# Altium schematic sheet Main_board.SchDoc
size A1; SheetNumber: 1; SheetTotal: 1
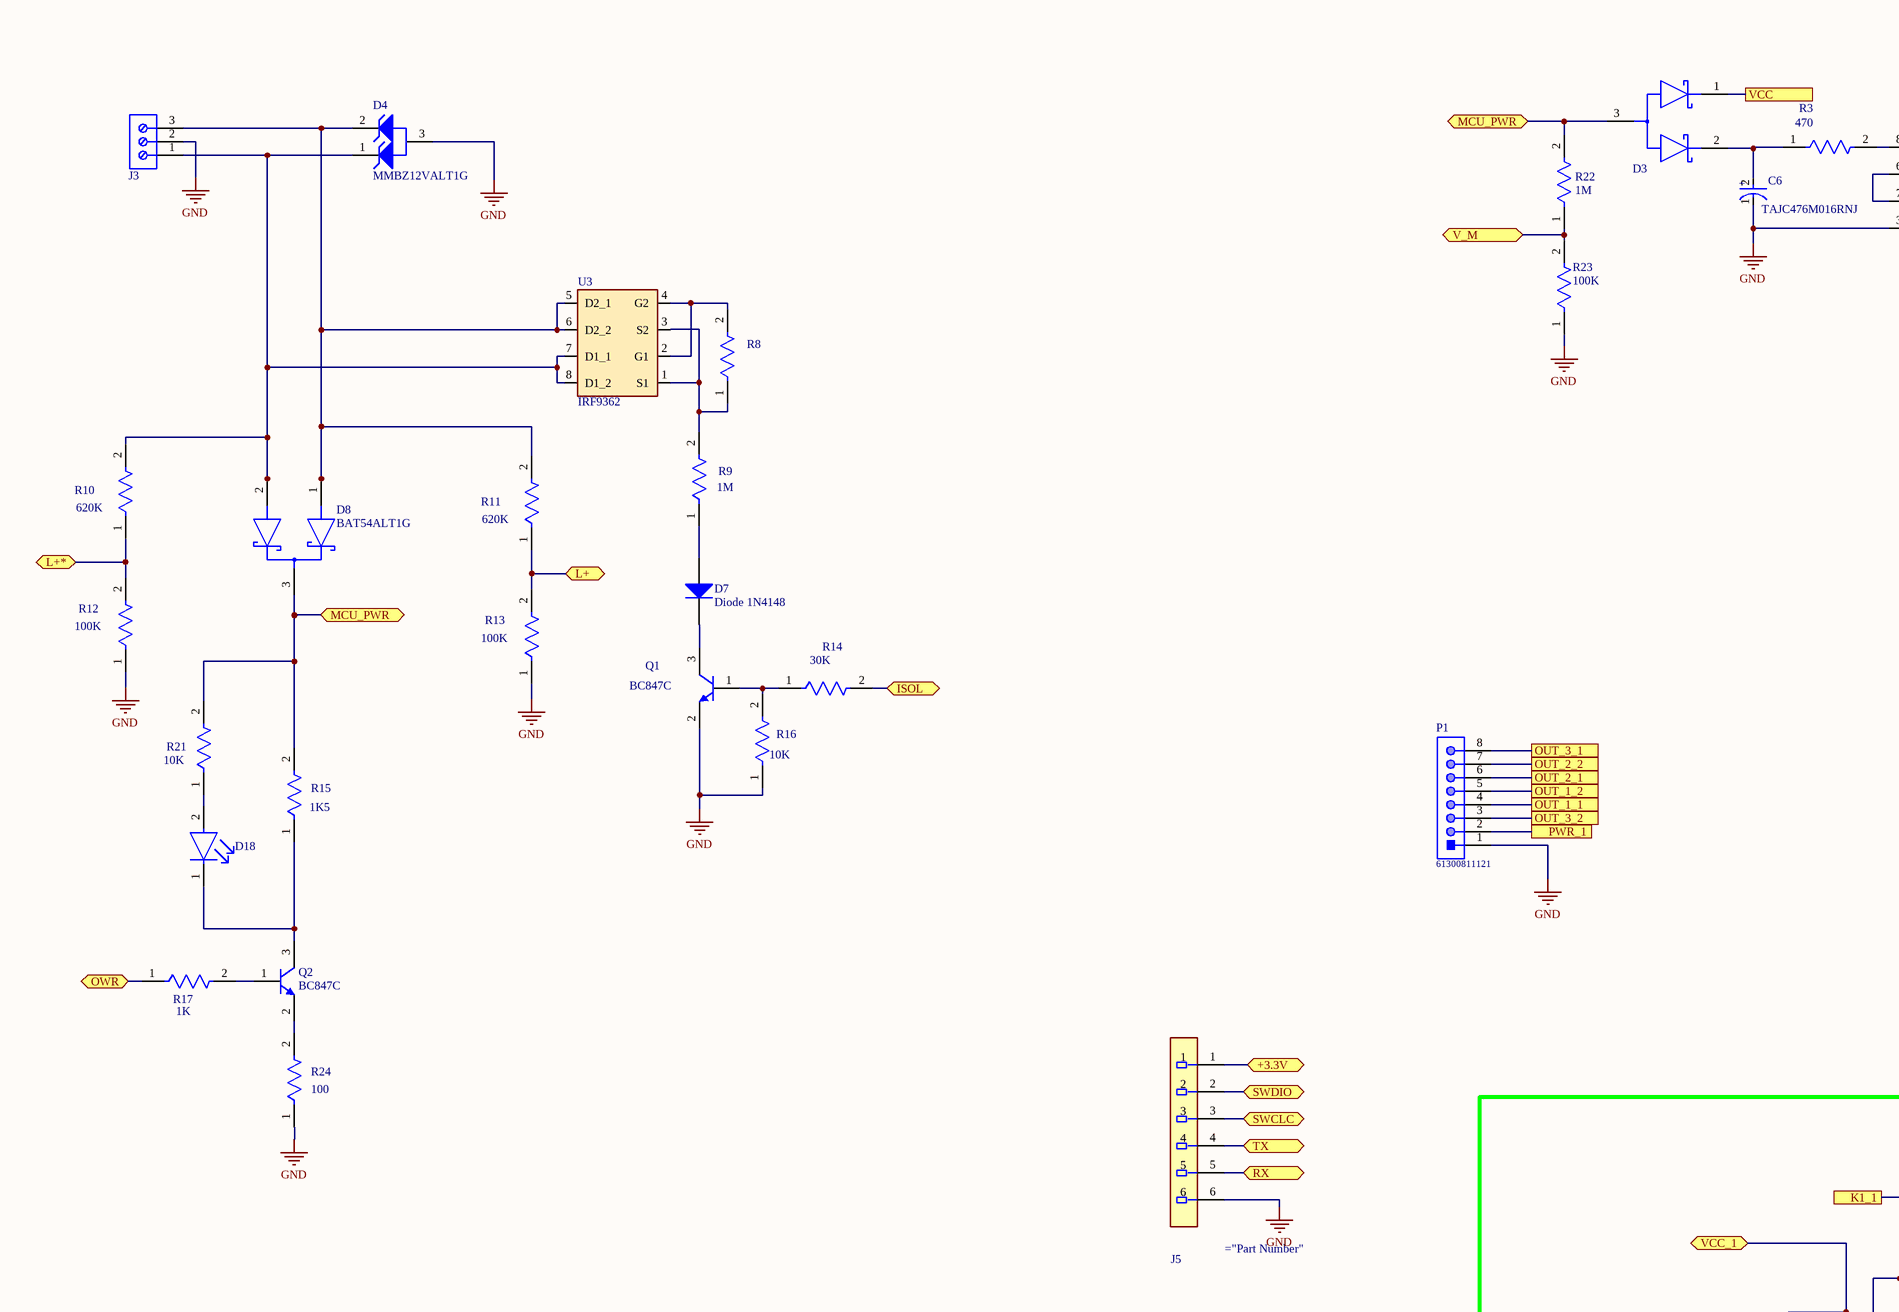
[diagram p0: Main_board.SchDoc, top left]
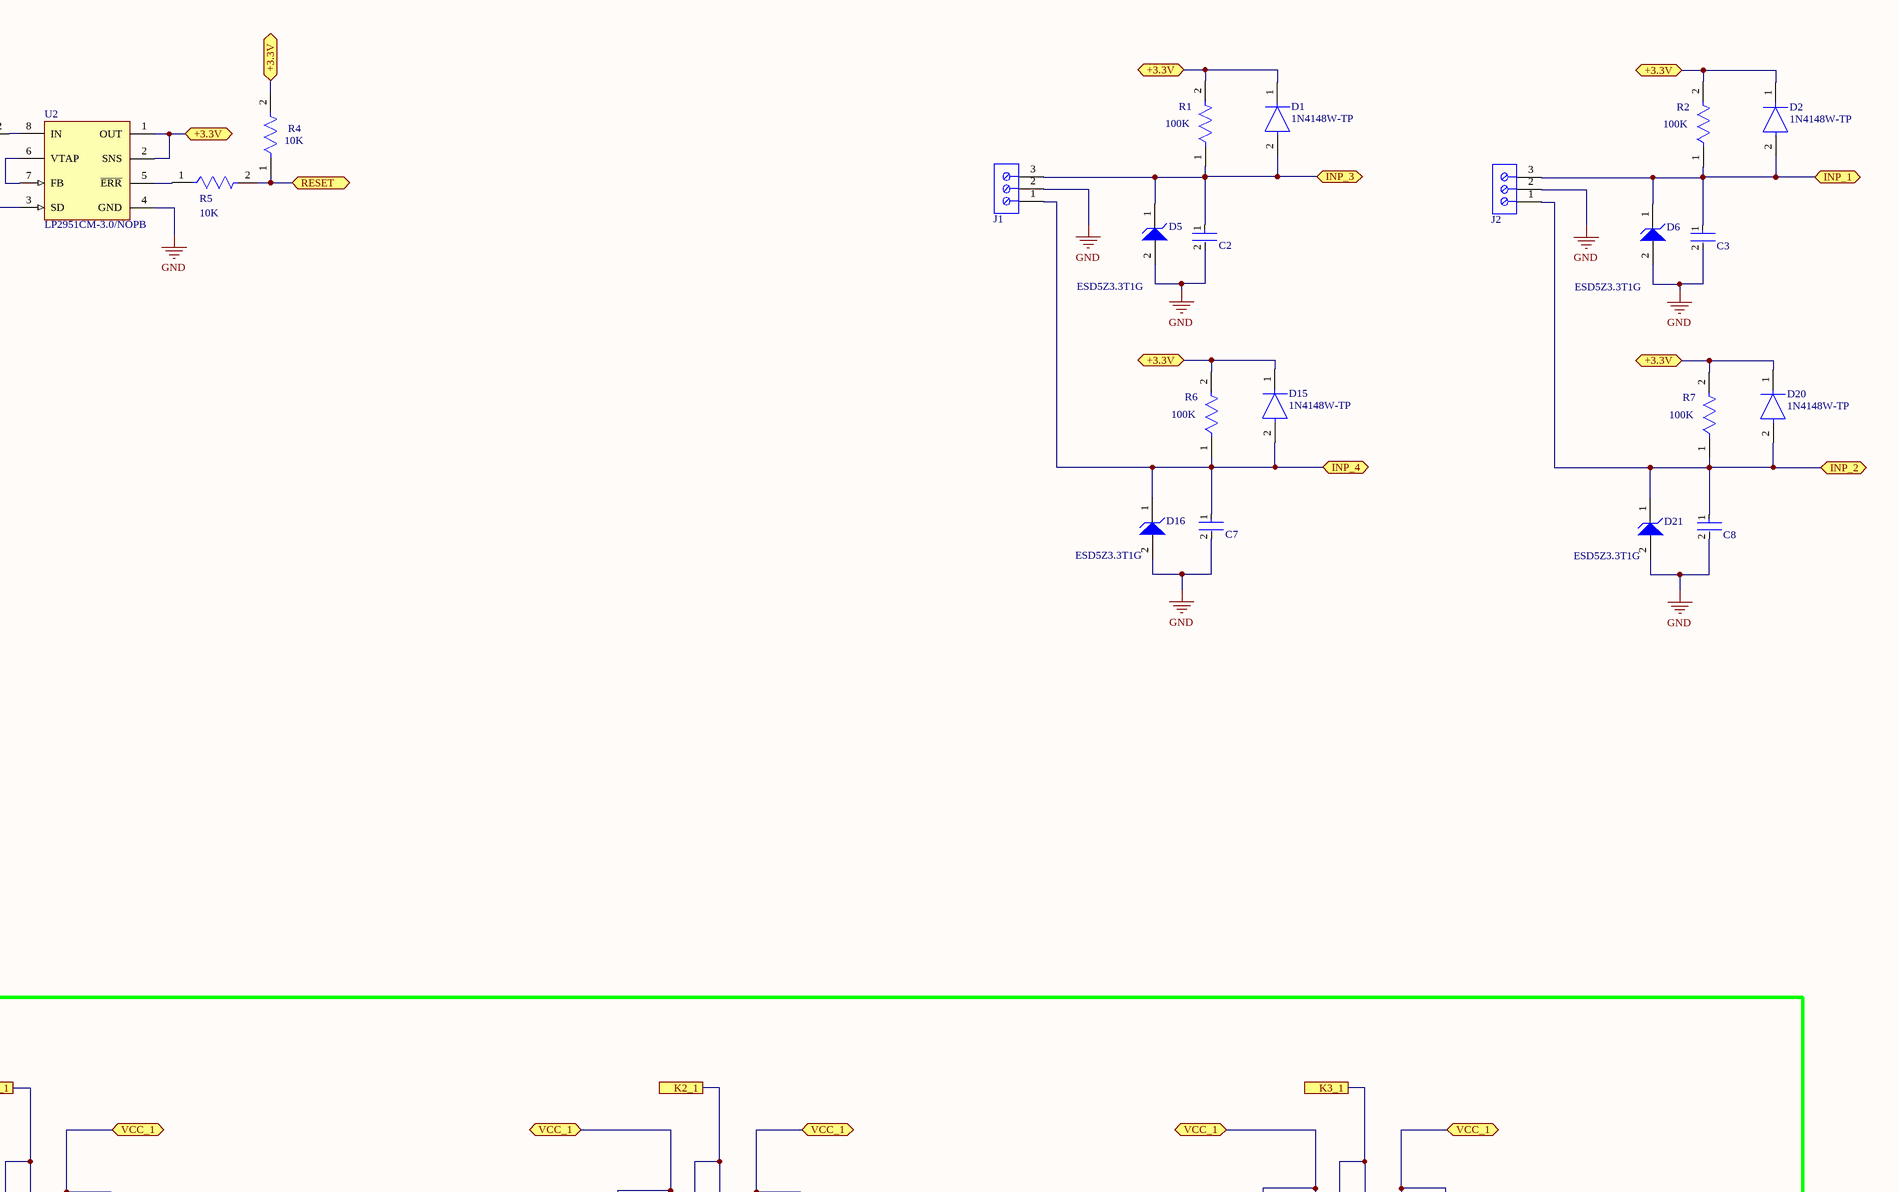
[diagram p1: Main_board.SchDoc, top right]
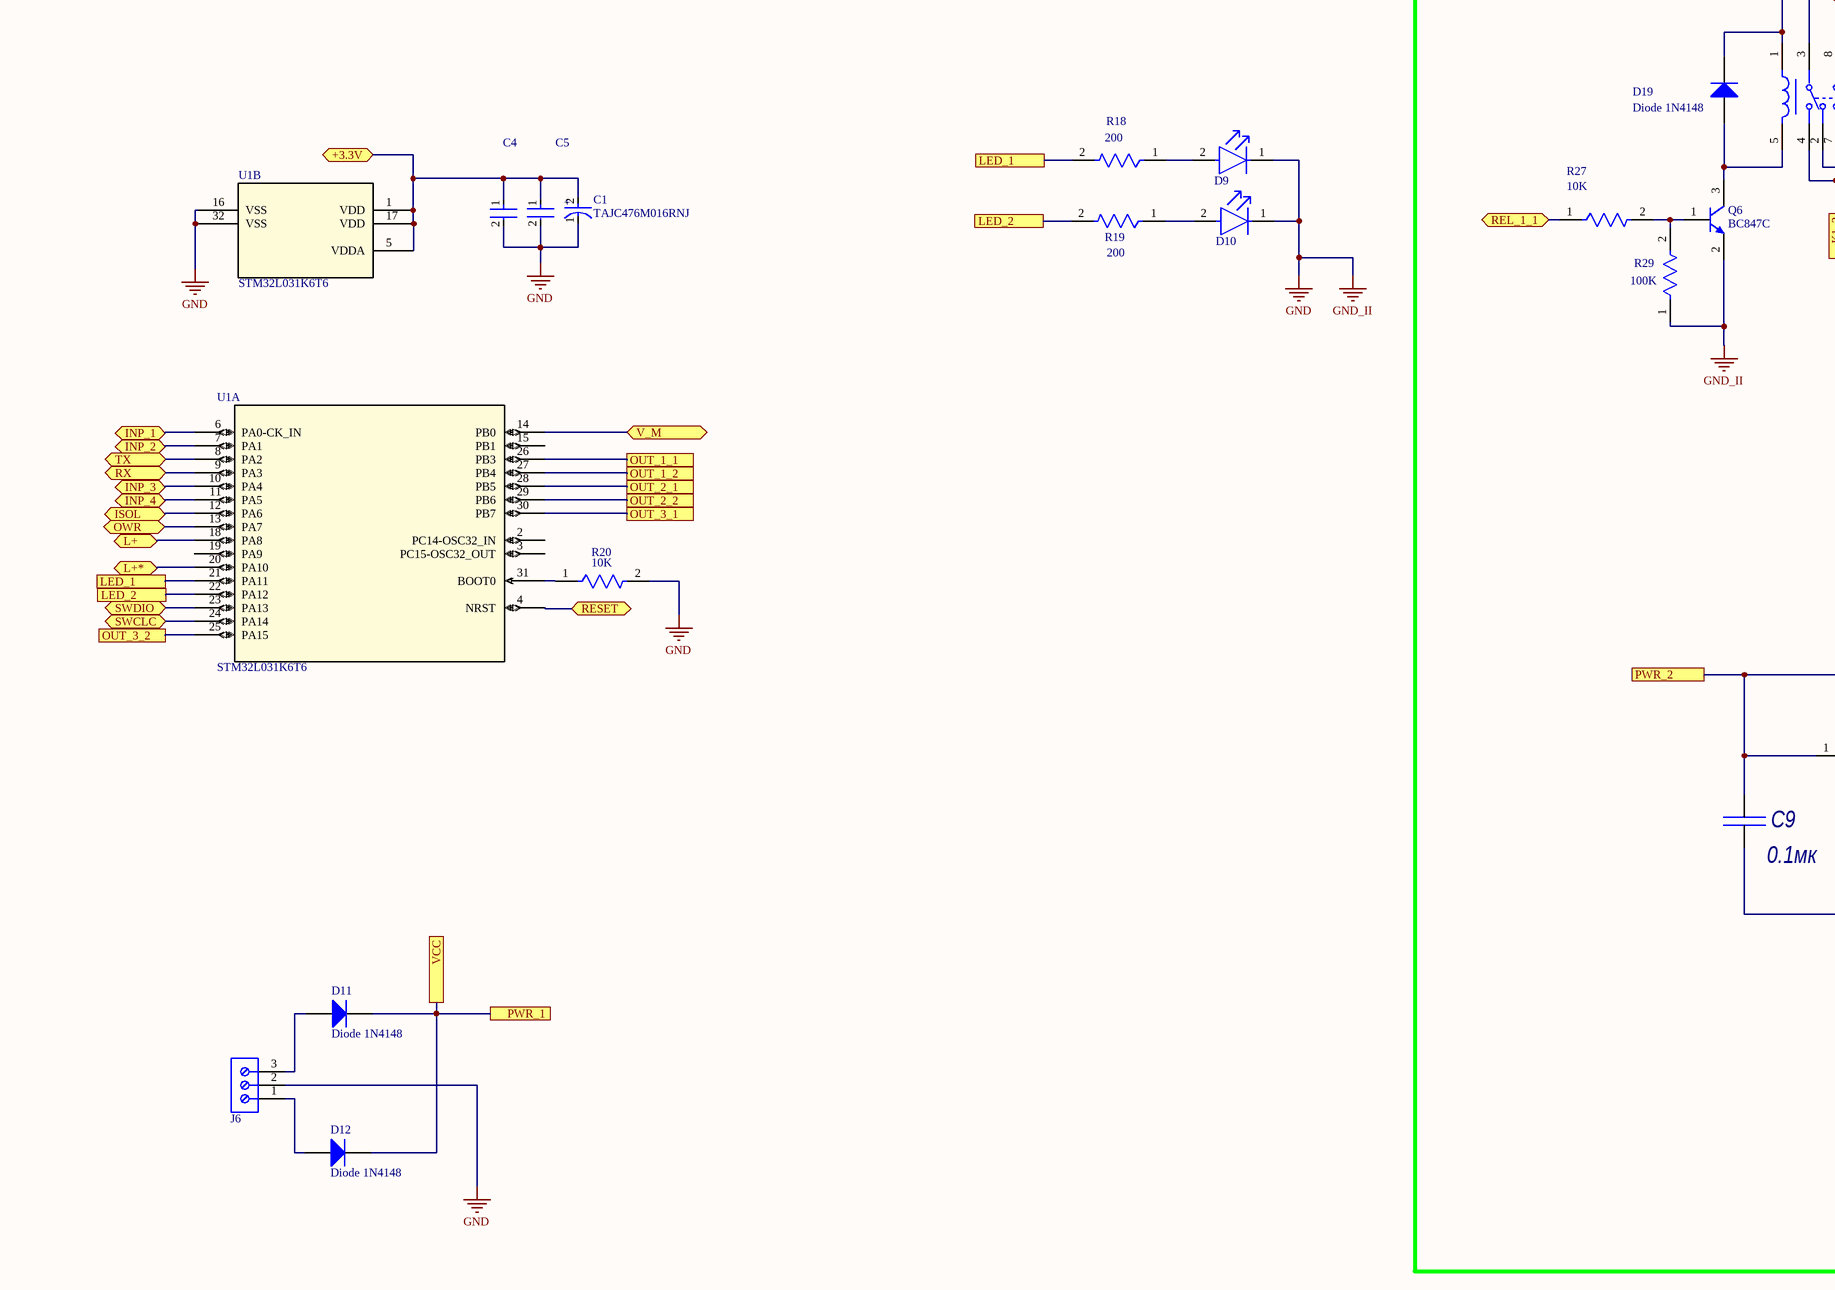
[diagram p2: Main_board.SchDoc, bottom left]
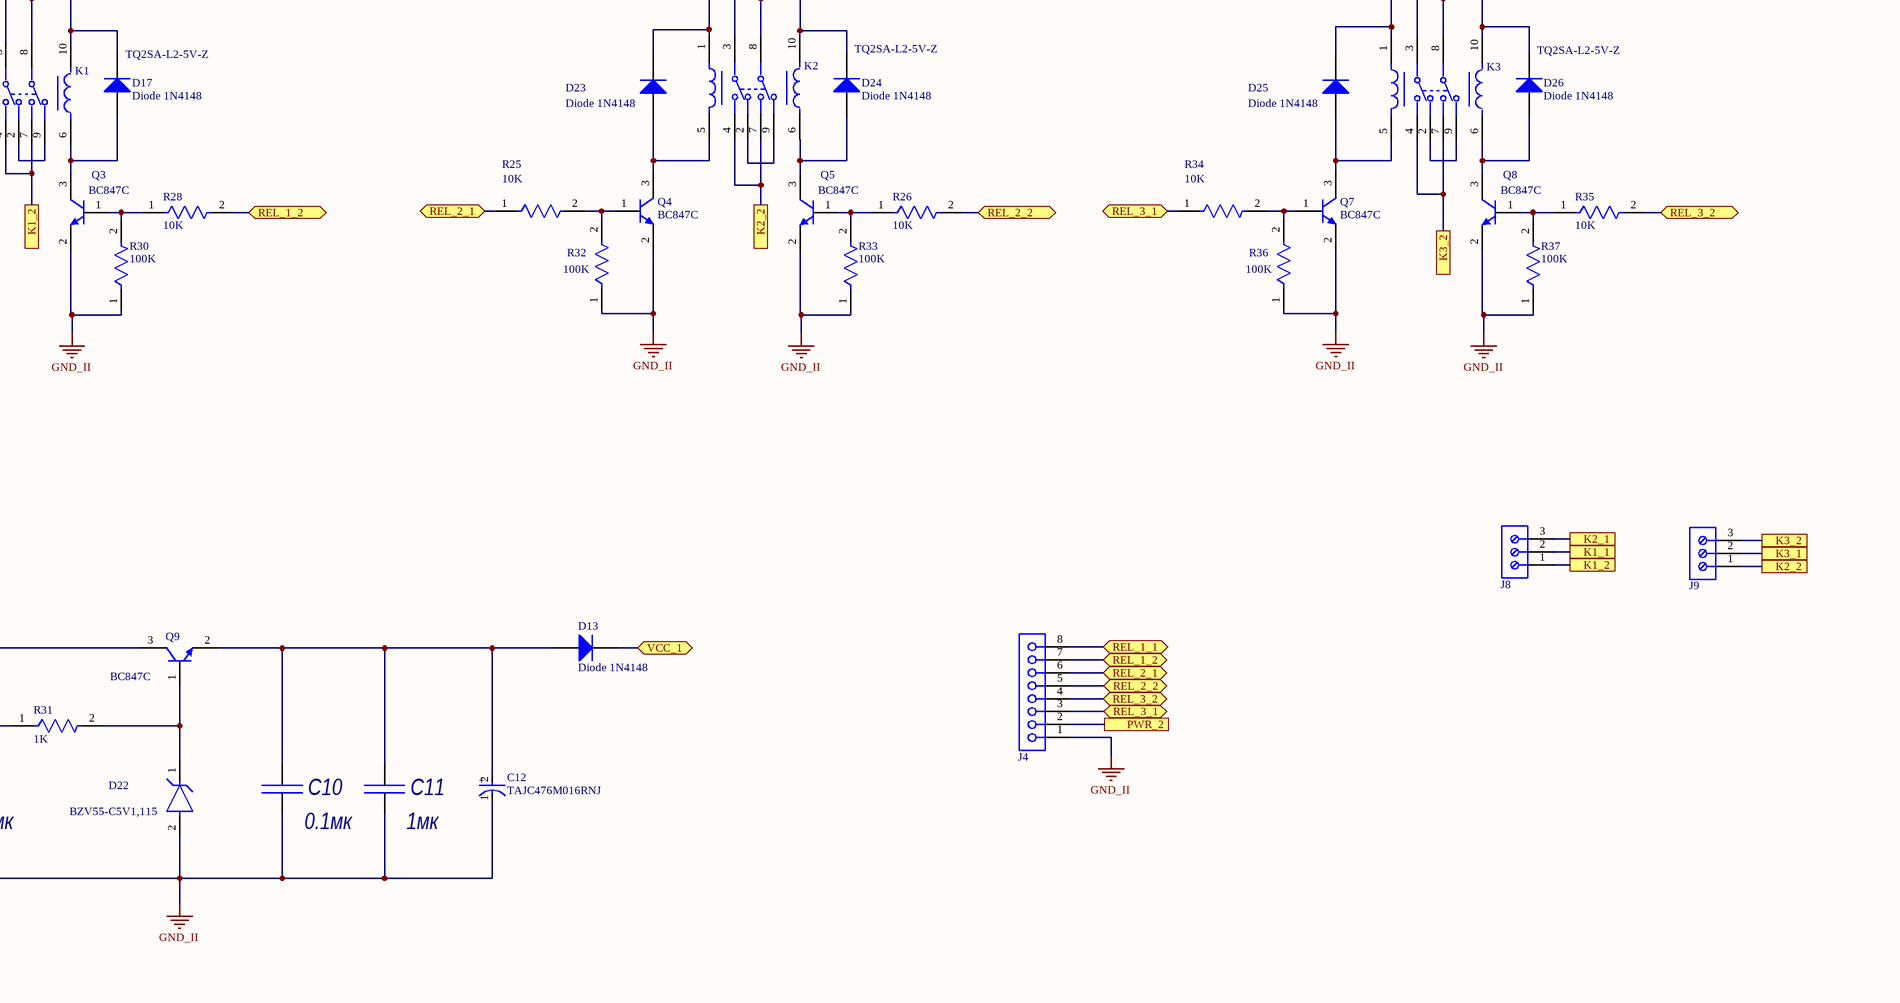
[diagram p3: Main_board.SchDoc, bottom right]

## Parts
C1  TAJC476M016RNJ  [FP-TAJC-MFG]
C2  C0805C224K5RACTU  [KEMET_C0805C-DN_IPC_B]  (value not drawn)
C3  C0805C224K5RACTU  [KEMET_C0805C-DN_IPC_B]  (value not drawn)
C4  C0805C224K5RACTU  [KEMET_C0805C-DN_IPC_B]  (value not drawn)
C5  C0805C224K5RACTU  [KEMET_C0805C-DN_IPC_B]  (value not drawn)
C6  TAJC476M016RNJ  [FP-TAJC-MFG]
C7  C0805C224K5RACTU  [KEMET_C0805C-DN_IPC_B]  (value not drawn)
C8  C0805C224K5RACTU  [KEMET_C0805C-DN_IPC_B]  (value not drawn)
C9  0.1мк  [KEMET_C0805C-DN_IPC_A]
C10  0.1мк  [KEMET_C0805C-DN_IPC_A]
C11  1мк  [KEMET_C0805C-DN_MFG]
C12  TAJC476M016RNJ  [FP-TAJC-MFG]
D1  1N4148W-TP  [FP-SOD-123-IPC_A]
D2  1N4148W-TP  [FP-SOD-123-IPC_A]
D3  BAT54С  [On_Semiconductor_318-08_IPC_B]  (value not drawn)
D4  MMBZ12VALT1G  [ONSC-SOT-23-3-318-08_V]
D5  ESD5Z3.3T1G  [ONSC-SOD-523-2-502-01_V]
D6  ESD5Z3.3T1G  [ONSC-SOD-523-2-502-01_V]
D7  Diode 1N4148  [1N4148WT7]
D8  BAT54ALT1G  [On_Semiconductor_318-08_IPC_B]
D9  150080SS75000  [Wurth_Electronics_0_MFG]  (value not drawn)
D10  150080SS75000  [LED_GREEN]  (value not drawn)
D11  Diode 1N4148  [SOD2513X120N]
D12  Diode 1N4148  [SOD2513X120N]
D13  Diode 1N4148  [SOD2513X120N]
D15  1N4148W-TP  [FP-SOD-123-IPC_A]
D16  ESD5Z3.3T1G  [ONSC-SOD-523-2-502-01_V]
D17  Diode 1N4148  [SOD2513X120N]
D18  150080SS75000  [Wurth_Electronics_0_MFG]  (value not drawn)
D19  Diode 1N4148  [SOD2513X120N]
D20  1N4148W-TP  [FP-SOD-123-IPC_A]
D21  ESD5Z3.3T1G  [ONSC-SOD-523-2-502-01_V]
D22  BZV55-C5V1,115  [FP-SOD80C-MFG]
D23  Diode 1N4148  [SOD2513X120N]
D24  Diode 1N4148  [SOD2513X120N]
D25  Diode 1N4148  [SOD2513X120N]
D26  Diode 1N4148  [SOD2513X120N]
J1  691103110003  [691103110003]  (value not drawn)
J2  691103110003  [691103110003]  (value not drawn)
J3  691103110003  [691103110003]  (value not drawn)
J4  61300811821  [61300811821]  (value not drawn)
J5  SWR25X-NRTC-S06-ST-BA  [Sullins_SWR25X-NRTC-S06-ST-BA_MFG]  (value not drawn)
J6  691103110003  [691103110003]  (value not drawn)
J8  691103110003  [691103110003]  (value not drawn)
J9  691103110003  [691103110003]  (value not drawn)
K1  TQ2SA-L2-5V-Z  [FP-TQ2SA-L2-5V-Z-MFG]
K2  TQ2SA-L2-5V-Z  [FP-TQ2SA-L2-5V-Z-MFG]
K3  TQ2SA-L2-5V-Z  [FP-TQ2SA-L2-5V-Z-MFG]
P1  61300811121  [61300811121]
Q1  BC847C  [SOT23-3_ONS-M]
Q2  BC847C  [SOT23-3_ONS-M]
Q3  BC847C  [SOT23-3_ONS-M]
Q4  BC847C  [SOT23-3_ONS-M]
Q5  BC847C  [SOT23-3_ONS-M]
Q6  BC847C  [SOT23-3_ONS-M]
Q7  BC847C  [SOT23-3_ONS-M]
Q8  BC847C  [SOT23-3_ONS-M]
Q9  BC847C  [SOT23-3_ONS-M]
R1  100K  [FP-RC0603-0_55-MFG]
R2  100K  [FP-RC0603-0_55-MFG]
R3  470  [FP-RC0603-0_55-MFG]
R4  10K  [FP-RC0603-0_55-MFG]
R5  10K  [FP-RC0603-0_55-MFG]
R6  100K  [FP-RC0603-0_55-MFG]
R7  100K  [FP-RC0603-0_55-MFG]
R8  1M  [FP-RC0603-0_55-MFG]  (value not drawn)
R9  1M  [FP-RC0603-0_55-MFG]
R10  620K  [FP-RC0603-0_55-IPC_A]
R11  620K  [FP-RC0603-0_55-IPC_A]
R12  100K  [FP-RC0603-0_55-IPC_A]
R13  100K  [FP-RC0603-0_55-IPC_A]
R14  30K  [FP-RC0603-0_55-MFG]
R15  1K5  [FP-RC0603-0_55-MFG]
R16  10K  [FP-RC0603-0_55-MFG]
R17  1K  [FP-RC0603-0_55-MFG]
R18  200  [FP-RC0603-0_55-MFG]
R19  200  [FP-RC0603-0_55-MFG]
R20  10K  [FP-RC0603-0_55-MFG]
R21  10K  [FP-RC0603-0_55-MFG]
R22  1M  [FP-RC0603-0_55-MFG]
R23  100K  [FP-RC0603-0_55-MFG]
R24  100  [FP-RC0603-0_55-MFG]
R25  10K  [FP-RC0603-0_55-MFG]
R26  10K  [FP-RC0603-0_55-MFG]
R27  10K  [FP-RC0603-0_55-MFG]
R28  10K  [FP-RC0603-0_55-MFG]
R29  100K  [FP-RC0603-0_55-MFG]
R30  100K  [FP-RC0603-0_55-MFG]
R31  1K  [FP-RC0603-0_55-MFG]
R32  100K  [FP-RC0603-0_55-MFG]
R33  100K  [FP-RC0603-0_55-MFG]
R34  10K  [FP-RC0603-0_55-MFG]
R35  10K  [FP-RC0603-0_55-MFG]
R36  100K  [FP-RC0603-0_55-MFG]
R37  100K  [FP-RC0603-0_55-MFG]
U1  STM32L031K6T6  [LQFP32_7X7X1P4-M]  (parts A,B of 2)
U2  LP2951CM-3.0/NOPB  [SOIC127P600X175-8N]
U3  IRF9362  [SOIC127P600X175-8N]

## Ports
+3.3V (bidir), INP_1 (bidir), INP_2 (bidir), INP_3 (bidir), INP_4 (bidir), ISOL (bidir), K1_1, K1_2, K2_1, K2_2, K3_1, K3_2, L+ (bidir), L+* (bidir), LED_1, LED_2, MCU_PWR (bidir), OUT_1_1, OUT_1_2, OUT_2_1, OUT_2_2, OUT_3_1, OUT_3_2, OWR (bidir), PWR_1, PWR_2, REL_1_1 (bidir), REL_1_2 (bidir), REL_2_1 (bidir), REL_2_2 (bidir), REL_3_1 (bidir), REL_3_2 (bidir), RESET (bidir), RX (bidir), SWCLC (bidir), SWDIO (bidir), TX (bidir), V_M (bidir), VCC, VCC_1 (bidir)

## Nets
GND: C1.1(C) C2.2 C3.2 C4.2 C5.2 C6.1(C) C7.2 C8.2 C9.2 C10.2 C11.2 C12.1(C) D4.3(A) D5.2(A) D6.2(A) D9.1(C) D10.1(C) D16.2(A) D21.2(A) D22.2(A) J1.2 J2.2 J3.2 J4.1 J5.6 J6.2 P1.1 Q1.2(E) Q3.2(E) Q4.2(E) Q5.2(E) Q6.2(E) Q7.2(E) Q8.2(E) R12.1 R13.1 R16.1 R20.2 R23.1 R24.1 R29.1 R30.1 R32.1 R33.1 R36.1 R37.1 U1.16(VSS) U1.32(VSS) U2.3(SD) U2.4(GND)  [also labelled GND_II]
+3.3V: C1.2(A) C4.1 C5.1 D1.1(C) D2.1(C) D15.1(C) D20.1(C) J5.1 R1.2 R2.2 R4.2 R6.2 R7.2 U1.1(VDD) U1.5(VDDA) U1.17(VDD) U2.1(OUT) U2.2(SNS) ; port +3.3V
INP_1: C3.1 D2.2(A) D6.1(K) J2.3 R2.1 U1.6(PA0-CK_IN) ; port INP_1
INP_2: C8.1 D20.2(A) D21.1(K) J2.1 R7.1 U1.7(PA1) ; port INP_2
INP_3: C2.1 D1.2(A) D5.1(K) J1.3 R1.1 U1.10(PA4) ; port INP_3
INP_4: C7.1 D15.2(A) D16.1(K) J1.1 R6.1 U1.11(PA5) ; port INP_4
ISOL: R14.2 U1.12(PA6) ; port ISOL
K1_1: J8.2 K1.3 K1.8 ; port K1_1
K1_2: J8.1 K1.4 K1.7 ; port K1_2
K2_1: J8.3 K2.3 K2.8 ; port K2_1
K2_2: J9.1 K2.4 K2.7 ; port K2_2
K3_1: J9.2 K3.3 K3.8 ; port K3_1
K3_2: J9.3 K3.4 K3.7 ; port K3_2
L+: R11.1 R13.2 U1.18(PA8) ; port L+
L+*: R10.1 R12.2 U1.20(PA10) ; port L+*
LED_1: R18.2 U1.21(PA11) ; port LED_1
LED_2: R19.2 U1.22(PA12) ; port LED_2
MCU_PWR: D3.3(A) D8.3(CATHODE) R15.2 R21.2 R22.2 ; port MCU_PWR
OUT_1_1: P1.4 U1.26(PB3) ; port OUT_1_1
OUT_1_2: P1.5 U1.27(PB4) ; port OUT_1_2
OUT_2_1: P1.6 U1.28(PB5) ; port OUT_2_1
OUT_2_2: P1.7 U1.29(PB6) ; port OUT_2_2
OUT_3_1: P1.8 U1.30(PB7) ; port OUT_3_1
OUT_3_2: P1.3 U1.25(PA15) ; port OUT_3_2
OWR: R17.1 U1.13(PA7) ; port OWR
PWR_1: D3.1(1_CATHODE) D11.2(K) D12.2(K) P1.2 ; port VCC, port PWR_1
PWR_2: C9.1 J4.2 Q9.3(C) R31.1 ; port PWR_2
REL_1_1: J4.8 R27.1 ; port REL_1_1
REL_1_2: J4.7 R28.2 ; port REL_1_2
REL_2_1: J4.6 R25.1 ; port REL_2_1
REL_2_2: J4.5 R26.2 ; port REL_2_2
REL_3_1: J4.3 R34.1 ; port REL_3_1
REL_3_2: J4.4 R35.2 ; port REL_3_2
RESET: R4.1 R5.2 U1.4(NRST) ; port RESET
RX: J5.5 U1.9(PA3) ; port RX
SWCLC: J5.3 U1.24(PA14) ; port SWCLC
SWDIO: J5.2 U1.23(PA13) ; port SWDIO
TX: J5.4 U1.8(PA2) ; port TX
V_M: R22.1 R23.2 U1.14(PB0) ; port V_M
VCC_1: D13.2(K) D17.2(K) D19.2(K) D23.2(K) D24.2(K) D25.2(K) D26.2(K) K1.1(SET+) K1.10(RESET+) K2.1(SET+) K2.10(RESET+) K3.1(SET+) K3.10(RESET+) ; port VCC_1
NetC6_2: C6.2(A) D3.2(2_CATHODE) R3.1
NetC10_1: C10.1 C11.1 C12.2(A) D13.1(A) Q9.2(E)
NetD4_1: D4.1(K1) D8.2(2_ANODE) J3.1 R10.2 U3.7(D1_1) U3.8(D1_2)
NetD4_2: D4.2(K2) D8.1(1_ANODE) J3.3 R11.2 U3.5(D2_1) U3.6(D2_2)
NetD7_1: D7.1(A) R9.1
NetD7_2: D7.2(K) Q1.3(C)
NetD9_2: D9.2(A) R18.1
NetD10_2: D10.2(A) R19.1
NetD11_1: D11.1(A) J6.3
NetD12_1: D12.1(A) J6.1
NetD17_1: D17.1(A) K1.6(RESET-) Q3.3(C)
NetD18_1: D18.1(C) Q2.3(C) R15.1
NetD18_2: D18.2(A) R21.1
NetD19_1: D19.1(A) K1.5(SET-) Q6.3(C)
NetD22_1: D22.1(C) Q9.1(B) R31.2
NetD23_1: D23.1(A) K2.5(SET-) Q4.3(C)
NetD24_1: D24.1(A) K2.6(RESET-) Q5.3(C)
NetD25_1: D25.1(A) K3.5(SET-) Q7.3(C)
NetD26_1: D26.1(A) K3.6(RESET-) Q8.3(C)
NetK1_2: K1.2 K1.9
NetK2_2: K2.2 K2.9
NetK3_2: K3.2 K3.9
NetQ1_1: Q1.1(B) R14.1 R16.2
NetQ2_1: Q2.1(B) R17.2
NetQ2_2: Q2.2(E) R24.2
NetQ3_1: Q3.1(B) R28.1 R30.2
NetQ4_1: Q4.1(B) R25.2 R32.2
NetQ5_1: Q5.1(B) R26.1 R33.2
NetQ6_1: Q6.1(B) R27.2 R29.2
NetQ7_1: Q7.1(B) R34.2 R36.2
NetQ8_1: Q8.1(B) R35.1 R37.2
NetR3_2: R3.2 U2.8(IN)
NetR5_1: R5.1 U2.5(~{ERR})
NetR8_1: R8.1 R9.2 U3.1(S1) U3.3(S2)
NetR8_2: R8.2 U3.2(G1) U3.4(G2)
NetR20_1: R20.1 U1.31(BOOT0)
NetU2_6: U2.6(VTAP) U2.7(FB)

Not connected (* = marked no-connect by the designer): U1 2(PC14-OSC32_IN) 3(PC15-OSC32_OUT) 15(PB1) 19(PA9)

## Notes on the sheet
- (in symbol CMP-04424-000193-1) +

## Library data of the parts
C1 C6 C12 = CMP-04424-000193-1: 47uF 16V  ±20% 500mΩ 2312  SMD Tantalum Capacitor; Polarity: Polar; ESR (Equivalent Series Resistance): 500mR; Dissipation Factor: 6%; Leakage Current: 7.5uA; RoHS Compliant: Yes; Case/Package: 6032-28; Construction: Flat; Case Code (Imperial): 2312; Package Quantity: 1; Voltage Rating: 16V; Length: 6mm; Height - Seated (Max): 0.11inch; Voltage Rating (DC): 16V; Series: TAJ; Features: General Purpose; Radiation Hardening: No; Case Code (Metric): 6032; Tolerance: 20%; Max Operating Temperature: 125°C; Depth: 3.2mm; REACH SVHC: No SVHC; Capacitance: 47uF; Width: 3.2mm; Height: 2.8mm; Lead Free: Lead Free; Packaging: Tape and Reel; Number of Pins: 2; Min Operating Temperature: -55°C; Mount: Surface Mount; Termination: SMD/SMT
C2 C3 C7 C8 = C0805C224K5RACTU: 0.1uF
C9-C11 = C0805: Voltage: 50; Dielectric: X7R; ComponentDescription: =ComponentType+', '+Package+', '+Voltage+'В, '+Value+', '+Dielectric; ComponentType: Конденсатор керамический SMD
  C9 C10: Package: KEMET_C0805C-DN_IPC_A; Value: 0.1мк
  C11: Package: KEMET_C0805C-DN_MFG; Value: 1мк
D1 D2 D15 D20 = CMP-2000-04993-2: DIODE GEN PURP 100V 150MA SOD123; Max Reverse Leakage Current: 5uA; Max Surge Current: 2A; Reverse Recovery Time: 4ns; Polarity: Standard; Capacitance: 4pF; Max Forward Surge Current (Ifsm): 1A; Element Configuration: Single; Power Dissipation: 400mW; Forward Voltage: 1V; Radiation Hardening: No; Lead Free: Lead Free; Max Reverse Voltage (DC): 100V; Current Rating: 150mA; Forward Current: 150mA; Packaging: Tape and Reel; Number of Pins: 2; Package Quantity: 3000; Max Operating Temperature: 150°C; Min Operating Temperature: -65°C; Average Rectified Current: 150mA; Recovery Time: 4ns; Output Current: 150mA; Peak Non-Repetitive Surge Current: 2A; Width: 1.8mm; Voltage Rating (DC): 100V; Height: 1.2mm; Max Repetitive Reverse Voltage (Vrrm): 100V; Mount: Surface Mount; Length: 2.85mm
D3 = BAT54ALT1G
D4 = CMP-1061-00649-1: 40 W Peak Power Zener Transient Voltage Suppressor, Dual Common Anode Zeners for ESD Protection, 3-Pin SOT-23, Pb-Free, Tape and Reel; Manufacturer: On Semiconductor; V(BR) Typ (V): 12; IR Max (uA): 0.2; Direction: Unidirectional; PPK Max (W): 40; DatasheetVersion: Rev. 13; ComponentLink3Description: Package Specification; PartNumber: MMBZ12VALT1G; ComponentLink1Description: Manufacturer URL; ComponentLink2Description: Datasheet; Packing: Tape and Reel; RoHS: Pb-Free; ComponentLink2URL: http://www.onsemi.com/pub_link/Collateral/MMBZ5V6ALT1-D.PDF; Mounting Technology: Surface Mount; PackageDescription: 3-Pin Small Outline Transistor, Body 2.92 x 1.3 mm, Pitch 0.95 mm; PackageVersion: Rev. AP, 11/2009; PackageReference: SOT-23-3-318-08; ComponentLink3URL: http://www.onsemi.cn/pub_link/Collateral/318-08.PDF; ComponentLink1URL: http://www.onsemi.com/
D5 D6 D16 D21 = CMP-1063-00098-1: Transient Voltage Suppressor, Micro-Packaged Diode for ESD Protection, 2-Pin SOD-523, Pb-Free, Tape and Reel; Manufacturer: On Semiconductor; VRWM Max (V): 3.3; Number of Lines: 1; V(BR) Min (V): 5; PPK Max (W): 158; Direction: Unidirectional; IR Max (uA): 0.05; PackageReference: SOD-523-2-502-01; PackageVersion: Rev. E, 09/2010; RoHS: Pb-Free; ComponentLink3Description: Package Specification; Packing: Tape and Reel; ComponentLink1URL: http://www.onsemi.com/; DatasheetVersion: Rev. 10; ComponentLink2Description: Datasheet; Mounting Technology: Surface Mount; ComponentLink2URL: http://www.onsemi.cn/pub_link/Collateral/ESD5Z2.5T1-D.PDF; PartNumber: ESD5Z3.3T1G; PackageDescription: 2-Pin SOD, Body 1.2 x 0.8 mm; ComponentLink3URL: http://www.onsemi.com/pub_link/Collateral/502-01.PDF; ComponentLink1Description: Manufacturer URL
D7 D11-D13 D17 D19 D23-D26 = Diode 1N4148: High Conductance Fast Diode; Published: 8-Jun-2000; LatestRevisionDate: 17-Jul-2002; LatestRevisionNote: Re-released for DXP Platform.; DatasheetVersion: 1997; PackageReference: DO-35; Publisher: Altium Limited; PackageDescription: Diode, Axial; Body 3.8 x 1.9 mm (LxDia. max), Lead Dia. 0.53 mm (max); Code_JEDEC: DO-204-AH; ComponentLink1Description: Manufacturer Link; ComponentLink1URL: http://www.fairchildsemi.com/; ComponentLink2Description: Datasheet; ComponentLink2URL: http://www.fairchildsemi.com/ds/1N%2F1N4148.pdf
D22 = CMP-14400-000027-1: DIODE ZENER 5.1V 500MW LLDS; RoHS Compliant: Yes
J1-J3 J6 J8 J9 = 691103110003: WR-TBL Series 1031 Horizontal Entry Modular, Through Hole, pitch 3.5mm, 3p; Manufacturer: Wurth Elektronik; Pin Number: 3; Rated Current: 10A; Working Voltage: 125V; PCB/Cable/Panel: PCB; Modularity: Yes; ComponentLink1Description: Manufacturer Link; ComponentLink1URL: https://www.we-online.com/redexpert/article/691103110003?ad; ComponentLink2Description: Datasheet; ComponentLink2URL: https://www.we-online.com/redexpert/spec/691103110003?ad; Category: Terminal Blocks; Match Code: WR-TBL; Manufacturer Part Number: 691103110003; Mount: Through Hole; Operating Temperature Max: 105°C; Operating Temperature Min: -40°C; Packaging: Box; Pitch: 3.5mm; Orientation: Horizontal; Application: Pressure Clamp
J4 = 61300811821: WR-PHD Socket Header, THT, Vertical, pitch 2.54mm, 1 Row, 8P; Manufacturer: Wurth Elektronik; Contact Resistance: 20mΩ; Rated Current: 3A; Working Voltage: 250V; Withstanding Voltage: 500V; ComponentLink1Description: Website Link; ComponentLink1URL: https://www.we-online.com/redexpert/article/61300811821?ad; ComponentLink2Description: Datasheet Link; ComponentLink2URL: https://www.we-online.com/redexpert/spec/61300811821?ad; Manufacturer Part Number: 61300811821; Category: Board-to-Board Connectors; Match Code: WR-PHD; Mount: Through Hole; Operating Temperature Max: 125°C; Operating Temperature Min: -40°C; Packaging: Tray; Gender: Socket Header; Number of Pins: 8; Number of Rows: 1; Orientation: Vertical; Pitch: 2.54mm
K1-K3 = CMP-05607-000158-1: RELAY TELECOM DPDT 2A 5VDC; Coil Resistance: 178R; Coil Type: Latching, Dual Coil; Insertion Loss: 0.8dB; Max Voltage Rating (AC): 125V; Coil Power: 140mW; Release Time: 4ms; Voltage Rating (DC): 220V; Coil Voltage (DC): 5V; Coil Current: 28.1mA; Mount: Surface Mount; Depth: 11.5mm; Throw Configuration: DPDT; Package Quantity: 500; Min Operating Temperature: -40°C; Packaging: Tape and Reel; Termination: Gull Wing; Max Current Rating: 2A; Contact Material: Gold; Lead Free: Lead Free; Power Consumption: 140mW; Weight: 2g; Relay Type: Telecom; Series: TQ-SMD; Operate Time: 4ms; Radiation Hardening: No; Max Operating Temperature: 85°C; Number of Pins: 10; Contact Current Rating: 2A; RoHS Compliant: Yes; Voltage Rating (AC): 125V; Length: 14mm; Max Voltage Rating (DC): 220V
P1 = CMP-1502-01076-1: THT Vertical Pin Header WR-PHD, Pitch 2.54 mm, Single Row, 8 pins; Manufacturer: Wurth Elektronik; Rated Current: 3A; Pin Number: 8; Working Voltage: 250VAC; Gender: Male; Contact Resistance: 20mOhm; Pitch: 2.54mm; Withstanding Voltage: 500VAC; Publisher: WurthElektronik; Operating Temperature: -40to105degC; Orientation: Vertical; Row Number: Single; Part Number: 61300811121; Package Reference: 61300811121; Mounting Technology: THT; Packaging: Bag; Manufacturer URL: http://www.we-online.de; Datasheet URL: https://katalog.we-online.de/em/datasheet/6130xx11121.pdf
Q1-Q9 = BC847C: NPN Silicon AF Transistor, 45 V VCEO, 100 mA IC, SOT23, Reel, Green; Manufacturer: Infineon; Ptot (max): 330Â mW; VEBO (max): 6Â V; IBM (max): 200Â mA; VCBO (max): 50Â V; Green: TRUE; fT (typ): 250Â MHz; VCEO (max): 45Â V; IC (max): 100Â mA; ICBO (max): 15Â nA; Polarity: NPN; PartNumber: BC847C; PackageVersion: Apr-08; ComponentLink1Description: Manufacturer URL; ComponentLink2Description: Datasheet; ComponentLink3URL: http://www.infineon.com/dgdl/SOT23-Package_Overview.pdf?folderId=db3a30431936bc4b0119532290053c66&fileId=db3a30431936bc4b0119533468123c85; ComponentLink3Description: Package Specification; ComponentLink1URL: http://www.infineon.com/; Packing: Reel; ComponentLink2URL: http://www.infineon.com/dgdl/bc847series_bc848series_bc849series_bc850series.pdf?folderId=db3a304314dca389011541d30fa21656&fileId=db3a304314dca389011541d4630a1657; ICM (max): 200Â mA; Mounting Technology: Surface Mount; PackageReference: SOT23; PackageDescription: 3-Pin Small Outline Transistor Package, 1.3 x 2.9 mm Body, 0.95 mm Pitch
R1-R37 = CMP-2000-06932-2: RES 20K OHM 1% 1/10W 0603; Voltage Rating: 50V; Temperature Coefficient: 100ppm/°C; Power Rating: 100mW; Resistance: 20kR; Height: 0.022inch; REACH SVHC: No SVHC; Case Code (Metric): 1608; Depth: 0.8mm; Tolerance: 1%; Min Operating Temperature: -55°C; Series: RC; RoHS Compliant: Yes; Resistor Type: Thick Film; Max Power Dissipation: 100mW; Features: Moisture Resistant; Max Operating Temperature: 155°C; Package Quantity: 1; Size Code: 0603; Packaging: Tape and Reel; Width: 0.031inch; Length: 0.063inch; Military Standard: Not; Technology: THICK FILM; Number of Terminations: 2; Termination: SMD/SMT; Construction: Rectangular; Case/Package: 0603; Number of Pins: 2; Lead Free: Lead Free; Voltage Rating (DC): 50V; Resistance Tolerance: 1%; Case Code (Imperial): 0603
U1 = STM32L031K6T6: No Description Available; Mfr_Name: STMicroelectronics; Copyright: Copyright (C) 2022 Ultra Librarian. All rights reserved.; Manufacturer_Part_Number: STM32L031K6T6; RefDes: RefDes; Type: DEV
U2 = LP2951CM-3.0/NOPB: Series of Adjustable Micropower Voltage Regulators, 8-pin Narrow SOIC, Pb-Free; Manufacturer: National Semiconductor; PackageTopMarking: NSZXTT*2951C*M30DD; PowerWise: N; CompType: LDO IC; PinCount: 8; DatasheetVersion: Jun-2009; Code_JEDEC: MS-012-AA; Code_IPC: SOIC127P600-8; PackageVersion: revM, May-2009; PackageDescription: SOIC Narrow, 4.9 x 3.9 x 1.45mm, 8 Lead, 1.27mm Pitch; RoHS: Y; PackageReference: M08A; PartNumber: LP2951CM-3.0/NOPB